# Altium schematic sheet AIM2 - ADCS Multiplexing REVB.SchDoc: ADCS UART Multiplexing
size B; DrawnBy: DJW; DocumentNumber: 2; SheetNumber: 2; SheetTotal: 12
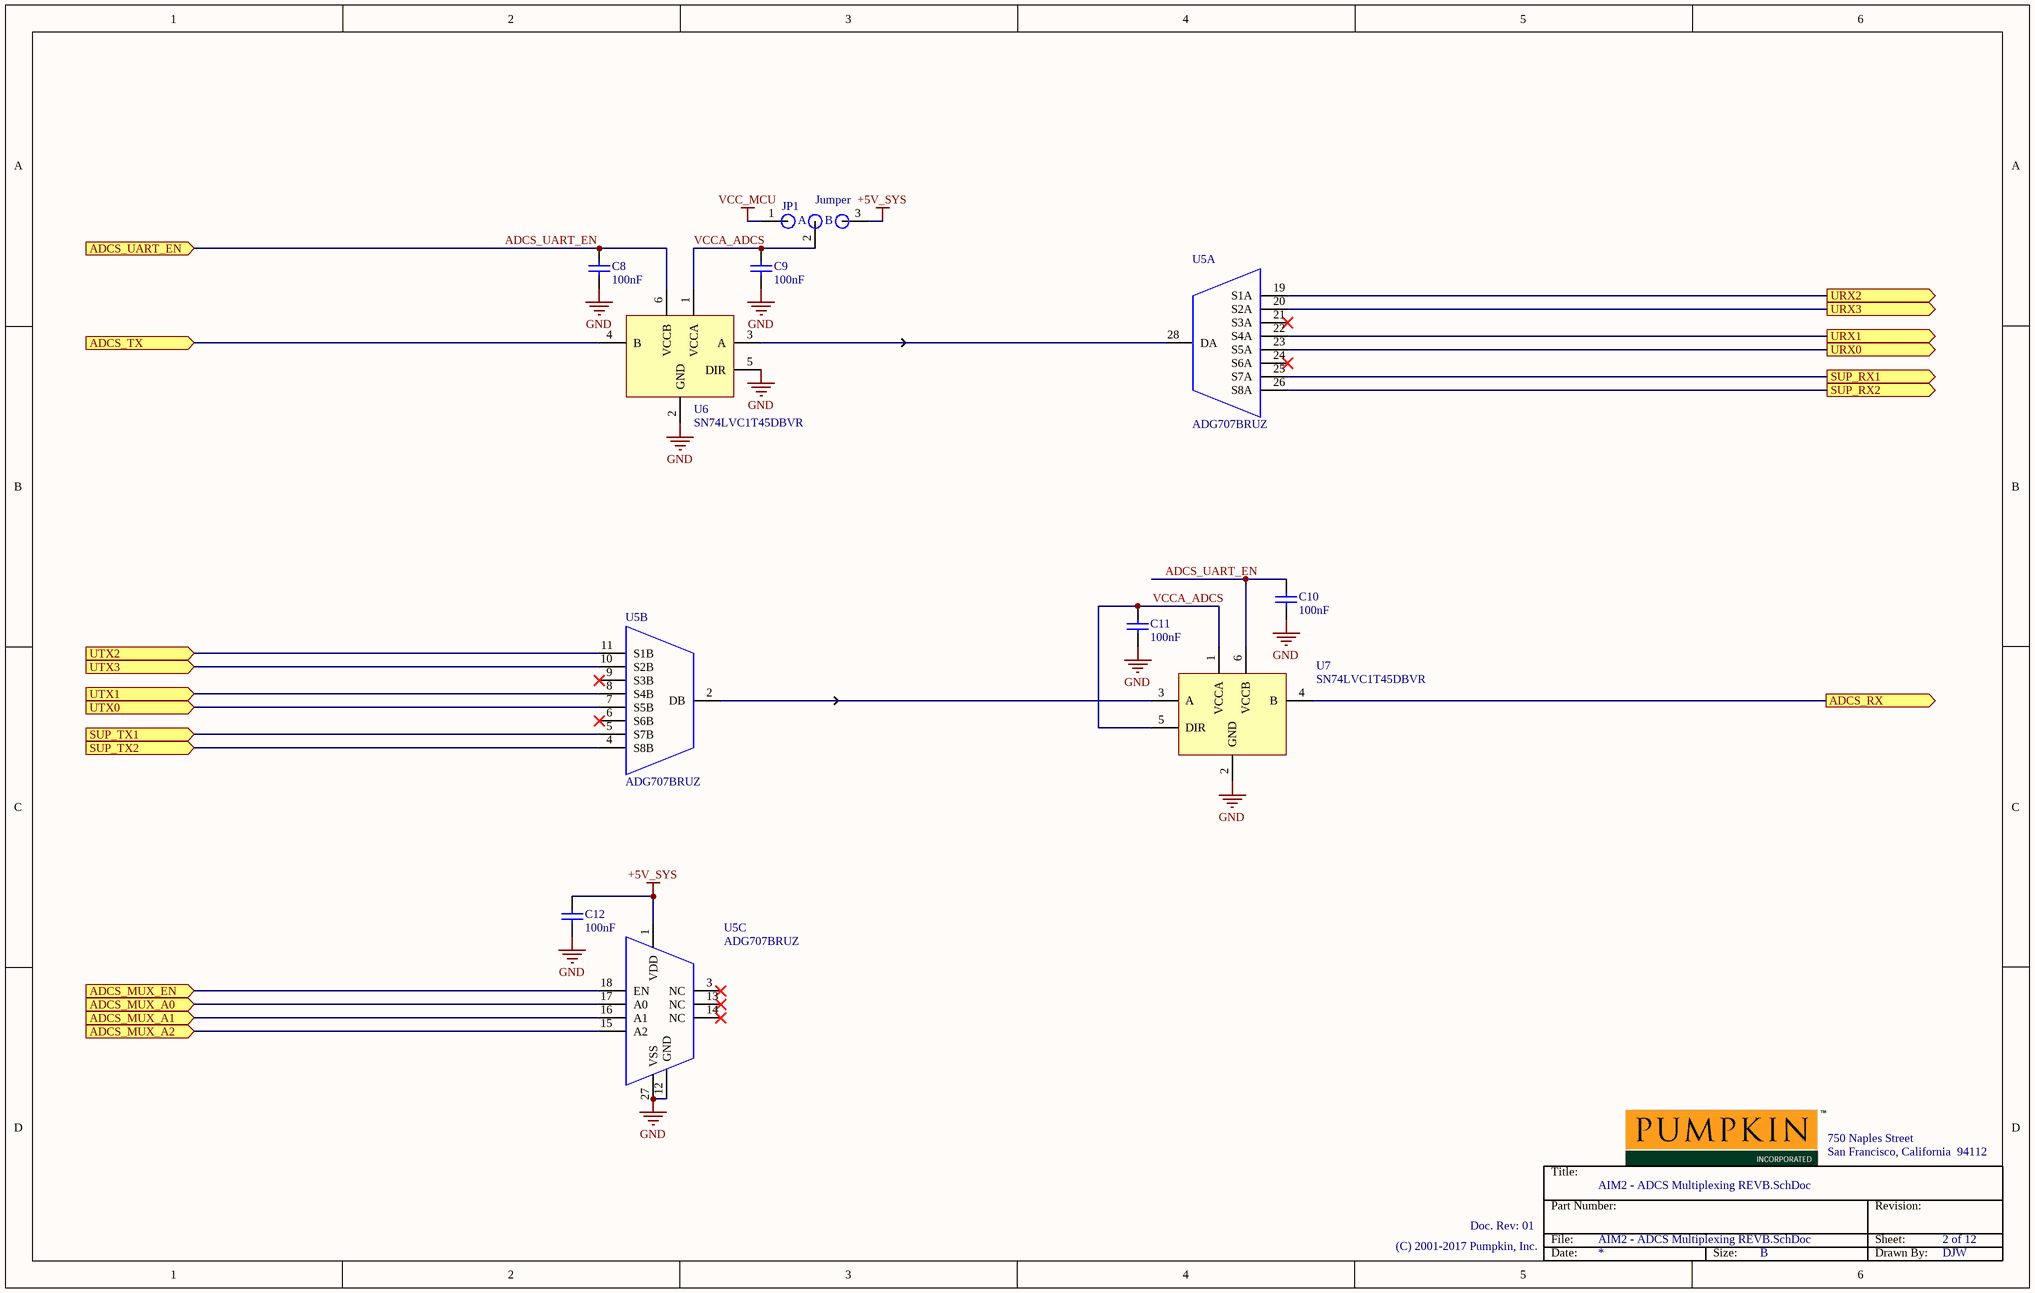
[diagram p0: AIM2 - ADCS Multiplexing REVB.SchDoc]

## Parts
C8  100nF  [0603 CAP]
C9  100nF  [0603 CAP]
C10  100nF  [0603 CAP]
C11  100nF  [0603 CAP]
C12  100nF  [0603 CAP]
JP1  Jumper  [0805 RES 2 way jumper - 1]
U5  ADG707BRUZ  [28-TSSOP]  (parts A,B,C of 3)
U6  SN74LVC1T45DBVR  [SOT23-6]
U7  SN74LVC1T45DBVR  [SOT23-6]

## Ports
ADCS_MUX_A0 (in), ADCS_MUX_A1 (in), ADCS_MUX_A2 (in), ADCS_MUX_EN (in), ADCS_RX (out), ADCS_TX (in), ADCS_UART_EN (in), SUP_RX1 (out), SUP_RX2 (out), SUP_TX1 (in), SUP_TX2 (in), URX0 (out), URX1 (out), URX2 (out), URX3 (out), UTX0 (in), UTX1 (in), UTX2 (in), UTX3 (in)

## Nets
+5V_SYS: C12.2 JP1.3 U5.1(VDD)
GND: C8.1 C9.1 C10.1 C11.1 C12.1 U5.12(GND) U5.27(VSS) U6.2(GND) U6.5(DIR) U7.2(GND)
VCC_MCU: JP1.1
ADCS_MUX_A0: U5.17(A0) ; port ADCS_MUX_A0
ADCS_MUX_A1: U5.16(A1) ; port ADCS_MUX_A1
ADCS_MUX_A2: U5.15(A2) ; port ADCS_MUX_A2
ADCS_MUX_EN: U5.18(EN) ; port ADCS_MUX_EN
ADCS_RX: U7.4(B) ; port ADCS_RX
ADCS_TX: U6.4(B) ; port ADCS_TX
ADCS_UART_EN: C8.2 C10.2 U6.6(VCCB) U7.6(VCCB) ; port ADCS_UART_EN
SUP_RX1: U5.25(S7A) ; port SUP_RX1
SUP_RX2: U5.26(S8A) ; port SUP_RX2
SUP_TX1: U5.5(S7B) ; port SUP_TX1
SUP_TX2: U5.4(S8B) ; port SUP_TX2
URX0: U5.23(S5A) ; port URX0
URX1: U5.22(S4A) ; port URX1
URX2: U5.19(S1A) ; port URX2
URX3: U5.20(S2A) ; port URX3
UTX0: U5.7(S5B) ; port UTX0
UTX1: U5.8(S4B) ; port UTX1
UTX2: U5.11(S1B) ; port UTX2
UTX3: U5.10(S2B) ; port UTX3
VCCA_ADCS: C9.2 C11.2 JP1.2 U6.1(VCCA) U7.1(VCCA) U7.5(DIR)
NetU5_2: U5.2(DB) U7.3(A)
NetU5_28: U5.28(DA) U6.3(A)

Not connected (* = marked no-connect by the designer): U5 3(NC)* 6(S6B)* 9(S3B)* 13(NC)* 14(NC)* 21(S3A)* 24(S6A)*

## Notes on the sheet
- Title:
- 750 Naples Street
- San Francisco, California  94112
- Doc. Rev: 01
- File:
- Part Number:
- Revision:
- Sheet:
- (C) 2001-2017 Pumpkin, Inc.
- Date:
- Size:
- B
- Drawn By:
- (in symbol Jumper 2 way 0805) A; B

## Library data of the parts
C8-C12 = Capacitor 100nF 0603: Capacitor 100nF 0603 X7R 50V 5%; Value: 100nF; Supplier 1: Digi-Key; Supplier Part Number 1: 399-7844-1-ND
JP1 = Jumper 2 way 0805: Jumper 0805 2 pos; Supplier 1: Digi-Key; Supplier Part Number 1: P0.0ACT-ND
U5 = ADG707BRUZ: IC Multiplexer 2x 8:1; Supplier 1: Digi-Key; Supplier Part Number 1: ADG707BRUZ-ND
U6 U7 = SN74LVC1T45DBVR: IC Logic Isolator 1 channel; Supplier 1: Digi-Key; Supplier Part Number 1: 296-16843-1-ND